# EAGLE design SimpleEXGCircuit (EAGLE 9.2.2)
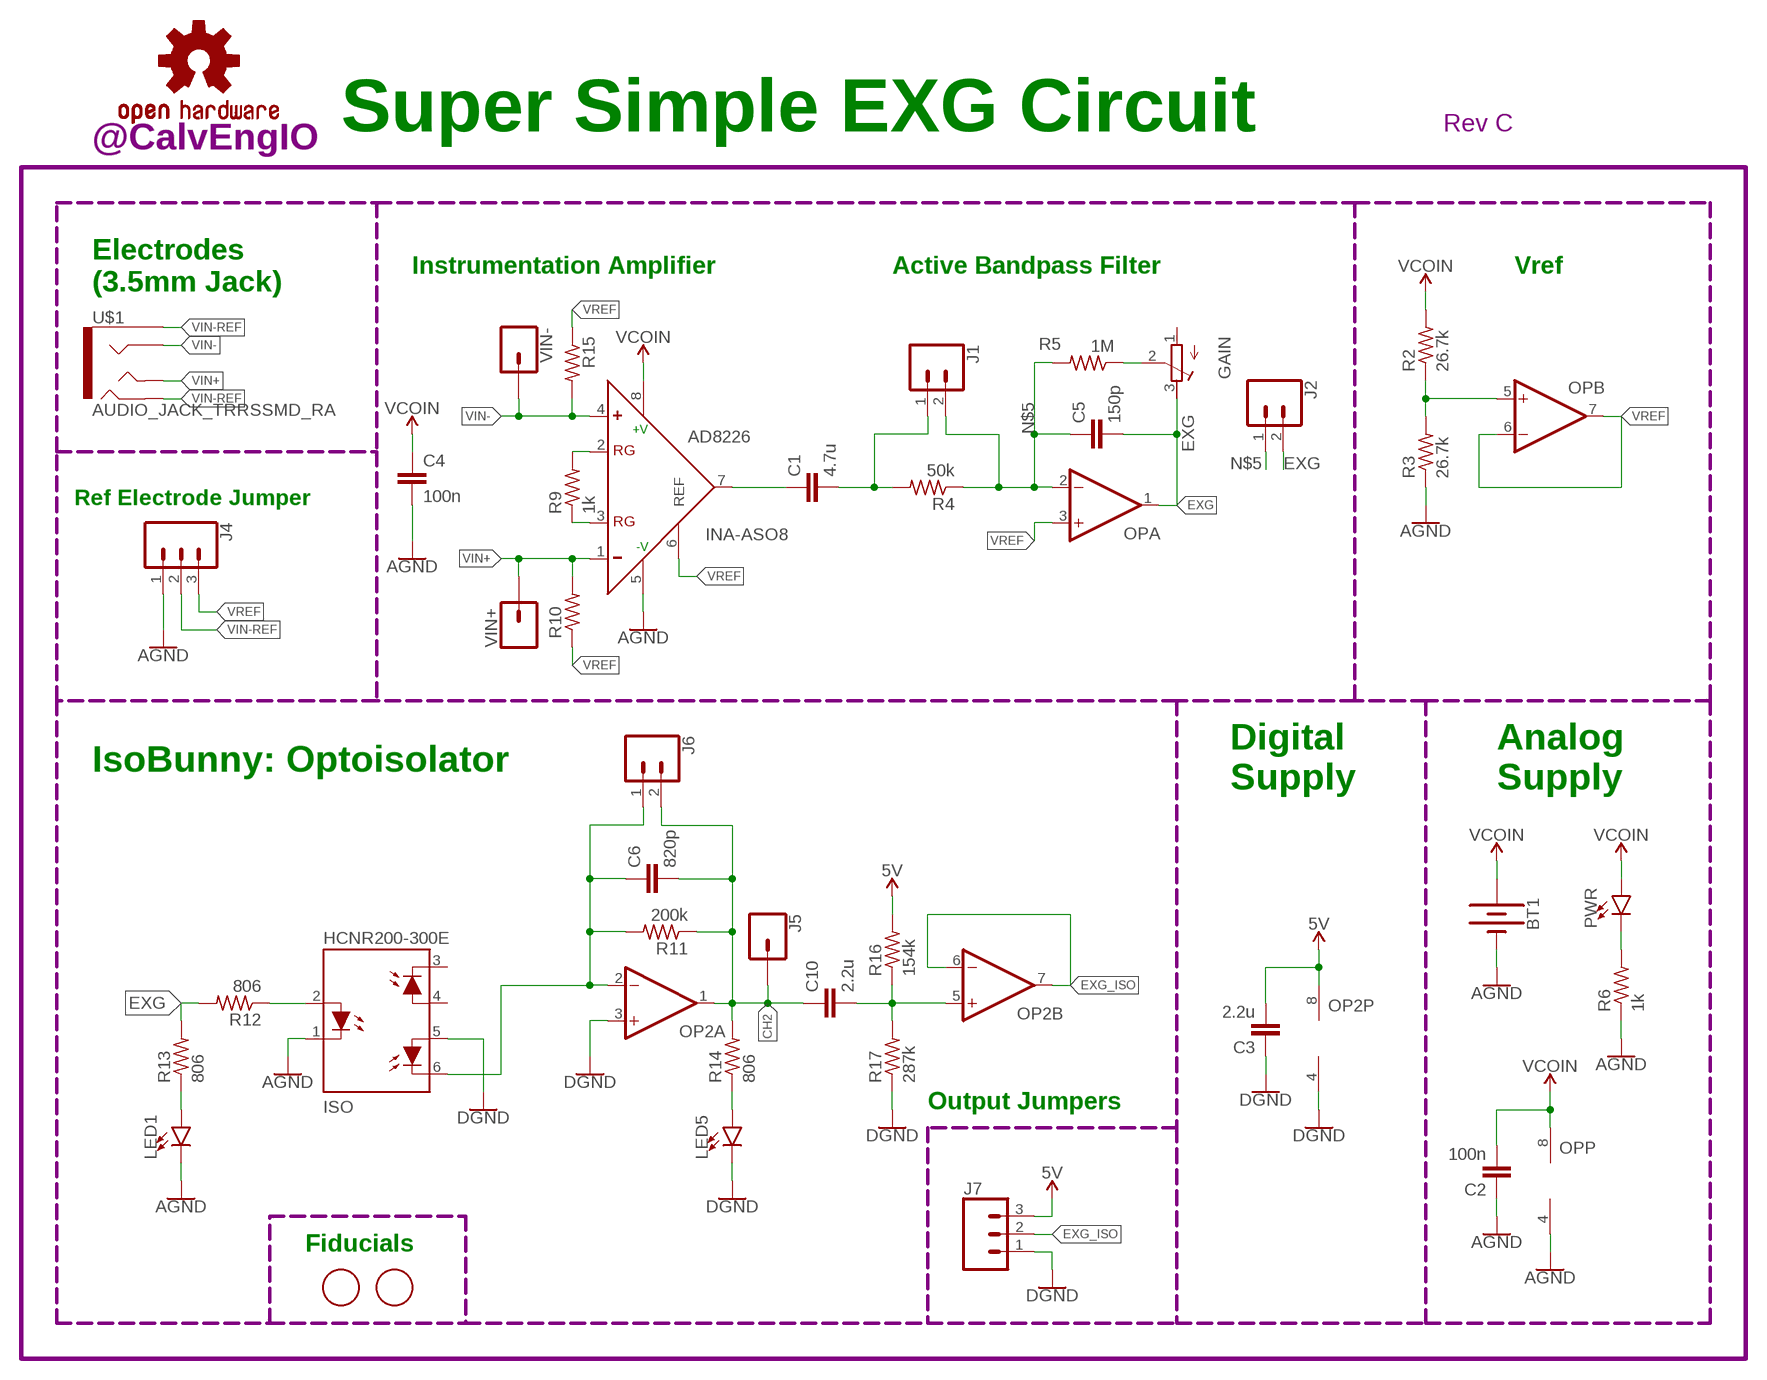
[diagram p0: schematic, sheet 1]

## Parts
AD8226  INA-ASO8  [SO8]
BT1  BATTERY-20MM_SMD_4LEGS_OVERPASTE  [BATTCON_20MM_4LEGS_OVERPASTE]
C1  4.7u  CAPACITOR0603  [C0603]
C2  100n  CAPACITOR0603  [C0603]
C3  2.2u  CAPACITOR0603  [C0603]
C4  100n  CAPACITOR0603  [C0603]
C5  150p  CAPACITOR0603  [C0603]
C6  820p  CAPACITOR0603  [C0603]
C10  2.2u  CAPACITOR0603  [C0603]
GAIN  TRIM-POT-P160  [16MMROTARYPOT]
ISO  HCNR200-300E  [DIP8-400]
J1  CONN_02  [1X02]
J2  CONN_02  [1X02]
J4  CONN_03  [1X03]
J5  CONN_01PTH_NO_SILK_KIT  [1X01NS_KIT]
J6  CONN_02  [1X02]
J7  CONN_03  [1X03]
LED1  LED1206  [LED-1206]
LED5  LED1206  [LED-1206]
LOGO1  REVISION.C  [REV.C]
LOGO4  OSHW-LOGOL  [OSHW-LOGO-L]
OP  OP-DUALR  [SO8]
OP2  OP-DUALR  [SO8]
PWR  LED1206  [LED-1206]
R2  26.7k  RESISTOR0603  [R0603]
R3  26.7k  RESISTOR0603  [R0603]
R4  50k  RESISTOR0603  [R0603]
R5  1M  RESISTOR0603  [R0603]
R6  1k  RESISTOR0603  [R0603]
R9  1k  RESISTOR0603  [R0603]
R10  RESISTOR0603  [R0603]
R11  200k  RESISTOR0603  [R0603]
R12  806  RESISTOR0603  [R0603]
R13  806  RESISTOR0603  [R0603]
R14  806  RESISTOR0603  [R0603]
R15  RESISTOR0603  [R0603]
R16  154k  RESISTOR0603  [R0603]
R17  287k  RESISTOR0603  [R0603]
U$1  AUDIO_JACK_TRRSSMD_RA  [AUDIO_JACK_3.5MM_TRRS_SMD_RA]
U$4  CALVENGIO_HANDLEHANDLE.05  [CALVENGIO_HANDLE.05]
U$5  FIDUCIAL  [FIDUCIAL_1MM]
U$6  FIDUCIAL  [FIDUCIAL_1MM]
VIN+  CONN_01  [1X01]
VIN-  CONN_01  [1X01]

## Nets
5V: C3.2 J7.3 OP2.8(P:V+) R16.2
AGND: AD8226.5(-V) BT1.2(-) C2.1 C4.2 ISO.1(C) J4.1 LED1.C OP.4(P:V-) R3.1 R6.1
CH2: C6.2 C10.1 J5.1 J6.2 OP2.1(A:OUT) R11.1 R14.2
DGND: C3.1 ISO.5(A2) J7.1 LED5.C OP2.3(A:+IN) OP2.4(P:V-) R17.1
EXG: C5.2 GAIN.3(E) J2.2 OP.1(A:OUT) R12.2 R13.2
EXG_ISO: J7.2 OP2.6(B:-IN) OP2.7(B:OUT)
INA: AD8226.7(OUT) C1.1
N$1: GAIN.2(S) R5.1
N$2: AD8226.2(RG) R9.2
N$3: OP.5(B:+IN) R2.1 R3.2
N$5: C5.1 J1.2 J2.1 OP.2(A:-IN) R4.1 R5.2
N$6: PWR.C R6.2
N$7: AD8226.3(RG) R9.1
N$8: C1.2 J1.1 R4.2
N$10: C6.1 ISO.6(C2) J6.1 OP2.2(A:-IN) R11.2
N$11: ISO.2(A) R12.1
N$12: C10.2 OP2.5(B:+IN) R16.1 R17.2
N$17: LED1.A R13.1
N$19: LED5.A R14.1
VCOIN: AD8226.8(+V) BT1.1(+) C2.2 C4.1 OP.8(P:V+) PWR.A R2.2
VIN+: AD8226.1(IN-) R10.2 U$1.TIP VIN+.1
VIN-: AD8226.4(IN+) R15.2 U$1.RING1 VIN-.1
VIN-REF: J4.2 U$1.EARTH U$1.RING2
VREF: AD8226.6(REF) J4.3 OP.3(A:+IN) OP.6(B:-IN) OP.7(B:OUT) R10.1 R15.1
Unconnected: GAIN.1(A) ISO.3(C1) ISO.4(A1)

## Notes on the sheet
- Super Simple EXG Circuit
- Instrumentation Amplifier | Active Bandpass Filter | Vref
- Electrodes
  (3.5mm Jack)
- Ref Electrode Jumper
- IsoBunny: Optoisolator
- Digital
  Supply
- Analog
  Supply
- Output Jumpers
- Fiducials

## Library data of the parts
AD8226 = CalvEngIO-AnalogIC:INA-A: Generic symbol and footprint for single supply instrumentation amplifier Fits AD8220, AD8226, AD8227, and others Source: http://www.analog.com/media/en/technical-documentation/data-sheets/AD8227.pdf
BT1 = CalvEngIO-Connectors:BATTERY: Battery - Single Cell A variety of battery chemistries, sizes, and footprints. Device List: 20MM_PTH - Coin Cell Battery Holder - 20mm (PTH) <https://www.sparkfun.com/products/783> 6.8MM_PTH - Coin Cell Battery Holder - 6.8MM(SMD) <https://www.digikey.com/product-detail/en/seiko-instruments/MS621FE-FL11E/728-1057-ND/1889208?WT.srch=1&gclid=CNOQ5a6LzdQCFZS2wAodXCkE0g> 12MM_SMD - Coin Cell Battery Holder - 12mm (SMD) <https://www.sparkfun.com/products/10592> 12MM_PTH - Coin Cell Battery Holder - 12mm (PTH) <https://www.sparkfun.com/products/7948> 20MM_SMD - 20mm Coin Cell Battery Holder (SMD) (2 legs) Used on the Big Time Watch Kit <https://www.sparkfun.com/products/11734> 20MM_SMD_4LEGS - Coin Cell Battery Holder - 20mm (SMD) <https://www.sparkfun.com/products/11892> 20MM_SMD_4LEGS_OVERPASTE - Coin Cell Battery Holder - 20mm (SMD) <https://www.sparkfun.com/products/11892> (Over-paste on the legs) 24.5MM_PTH - Coin Cell Battery Holder - 24.5mm (PTH) <https://www.sparkfun.com/products/8863> 9V - 9V Battery Holder - PC Mount Used on the SparkFun SparkPunk Sound Kit <https://www.sparkfun.com/products/11177> and SparkFun SparkPunk Sequencer Kit <https://www.sparkfun.com/products/12707> 18650 - Battery Holder - 18650 (PTH) <https://www.sparkfun.com/products/13113> AA - Battery Holder - 1xAA (PTH) <https://www.sparkfun.com/products/7949> AAA - Battery Holder - 1xAAA (PTH) <https://www.sparkfun.com/products/12718> AA_KIT - Battery Holder - 1xAA (PTH) <https://www.sparkfun.com/products/7949> Special kit package - pads only have exposed copper on one side of the board. AAA_KIT - Battery Holder - 1xAAA (PTH) <https://www.sparkfun.com/products/12718> Special kit package - pads only have exposed copper on one side of the board.; PROD_ID: PRT-11892; SF_SKU: BATT-10373
C1-C6 C10 = CalvEngIO-Passives:CAPACITOR
GAIN = CalvEngIO-Passives:TRIM-POT-P160
ISO = avago:HCNR20*: High-Linearity Analog Optocouplers Source: AV02-0886EN+DS+HCNR200+10Dec2011.pdf
J1 J2 J6 = CalvEngIO-Connectors:CONN_02: Multi connection point. Often used as Generic Header-pin footprint for 0.1 inch spaced/style header connections On any of the 0.1 inch spaced packages, you can populate with these: Break Away Headers - Straight <https://www.sparkfun.com/products/116> (PRT-00116) Break Away Male Headers - Right Angle <https://www.sparkfun.com/products/553> (PRT-00553) Female Headers <https://www.sparkfun.com/products/115> (PRT-00115) Break Away Headers - Machine Pin <https://www.sparkfun.com/products/117> (PRT-00117) Break Away Female Headers - Swiss Machine Pin <https://www.sparkfun.com/products/743> (PRT-00743) For SCREWTERMINALS and SPRING TERMINALS visit here: Screw Terimnals on SparkFun.com <https://www.sparkfun.com/search/results?term=Screw+Terminals> (5mm/3.5mm/2.54mm spacing) This device is also useful as a general connection point to wire up your design to another part of your project. Our various solder wires solder well into these plated through hole pads. Hook-Up Wire - Assortment (Stranded, 22 AWG) <https://www.sparkfun.com/products/11375> (PRT-11375) Hook-Up Wire - Assortment (Solid Core, 22 AWG) <https://www.sparkfun.com/products/11367> (PRT-11367) View the entire wire category on our website here <https://www.sparkfun.com/categories/141> Special notes: Molex polarized connector foot print use with: PRT-08233 with associated crimp pins and housings. 2.54_SCREWTERM for use with PRT-10571. 3.5mm Screw Terminal footprints for PRT-08084 5mm Screw Terminal footprints for use with PRT-08432
J4 J7 = CalvEngIO-Connectors:CONN_03: Multi connection point. Often used as Generic Header-pin footprint for 0.1 inch spaced/style header connections On any of the 0.1 inch spaced packages, you can populate with these: Break Away Headers - Straight <https://www.sparkfun.com/products/116> (PRT-00116) Break Away Male Headers - Right Angle <https://www.sparkfun.com/products/553> (PRT-00553) Female Headers <https://www.sparkfun.com/products/115> (PRT-00115) Break Away Headers - Machine Pin <https://www.sparkfun.com/products/117> (PRT-00117) Break Away Female Headers - Swiss Machine Pin <https://www.sparkfun.com/products/743> (PRT-00743) Stackable Header - 3 Pin (Female, 0.1") <https://www.sparkfun.com/products/13875> (PRT-13875) For SCREWTERMINALS and SPRING TERMINALS visit here: Screw Terimnals on SparkFun.com <https://www.sparkfun.com/search/results?term=Screw+Terminals> (5mm/3.5mm/2.54mm spacing) This device is also useful as a general connection point to wire up your design to another part of your project. Our various solder wires solder well into these plated through hole pads. Hook-Up Wire - Assortment (Stranded, 22 AWG) <https://www.sparkfun.com/products/11375> (PRT-11375) Hook-Up Wire - Assortment (Solid Core, 22 AWG) <https://www.sparkfun.com/products/11367> (PRT-11367) View the entire wire category on our website here <https://www.sparkfun.com/categories/141> Special notes: Molex polarized connector foot print use with SKU : PRT-08232 with associated crimp pins and housings.
J5 VIN+ VIN- = CalvEngIO-Connectors:CONN_01: Single connection point. Often used as Generic Header-pin footprint for 0.1 inch spaced/style header connections On any of the 0.1 inch spaced packages, you can populate with these: Break Away Headers - Straight <https://www.sparkfun.com/products/116> (PRT-00116) Break Away Male Headers - Right Angle <https://www.sparkfun.com/products/553> (PRT-00553) Female Headers <https://www.sparkfun.com/products/115> (PRT-00115) Break Away Headers - Machine Pin <https://www.sparkfun.com/products/117> (PRT-00117) Break Away Female Headers - Swiss Machine Pin <https://www.sparkfun.com/products/743> (PRT-00743) This device is also useful as a general connection point to wire up your design to another part of your project. Our various solder wires solder well into these plated through hole pads. Hook-Up Wire - Assortment (Stranded, 22 AWG) <https://www.sparkfun.com/products/11375> (PRT-11375) Hook-Up Wire - Assortment (Solid Core, 22 AWG) <https://www.sparkfun.com/products/11367> (PRT-11367) View the entire wire category on our website here <https://www.sparkfun.com/categories/141> Special notes: SMTSO-256-ET is a "flush mount" nut for a 4-40 screw. We mostly use this on specialty testbeds; it is a nice way to connect hardware to your PCB at an adjustable hieght. Also note, the SNAP packages are for using a snappable style connector. We sell a baggie of snaps and they are also used on two LilyPad designs: Snap Assortment - 30 pack (male and female) <https://www.sparkfun.com/products/11347> (DEV-11347) LilyPad Arduino SimpleSnap <https://www.sparkfun.com/products/10941> (DEV-10941) LilyPad SimpleSnap Protoboard <https://www.sparkfun.com/products/10940> (DEV-10940)
LED1 LED5 PWR = CalvEngIO-LED:LED: LED (Generic) Standard schematic elements and footprints for 5mm, 3mm, 1206, and 0603 sized LEDs. Generic LEDs with no color specified. LTST-C190KGKT: arrow indicates cathode
LOGO1 = CalvEngIO-Logos:REVISION.C
LOGO4 = CalvEngIO-Logos:OSHW-LOGO: Open-Source Hardware (OSHW) Logo This logo indicates the piece of hardware it is found on incorporates a OSHW license and/or adheres to the definition of open source hardware found here: http://freedomdefined.org/OSHW
OP OP2 = CalvEngIO-AnalogIC:OP-DUAL: Precision Micropower, Low Noise CMOS, Rail-to-Rail Input/Output Operational Amplifiers Source: http://www.analog.com/static/imported-files/data_sheets/AD8603_8607_8609.pdf; MPN: AD8607ARMZ-R2; OC_FARNELL: 1651293; OC_NEWARK: 19M8927
R2-R6 R9-R17 = CalvEngIO-Passives:RESISTOR
U$1 = CalvEngIO-Connectors:AUDIO_JACK_TRRS: Audio Jack - 3.5mm TRRS (SMD) This is a 3.5mm TRRS SMD audio jack. TRRS connectors are the audio-style connectors that you see on some phones, MP3 players and development boards. TRRS stands for “tip, ring, ring, sleeve,” which reflects that this has three conductors and a ground. SparkFun Products: Audio Jack <https://www.sparkfun.com/products/12639> mbed Starter Kit <https://www.sparkfun.com/products/12968> SparkFun TRRS 3.5mm Jack Breakout <https://www.sparkfun.com/products/11570>; PROD_ID: CONN-10676; SF_ID: PRT-12639
U$4 = CalvEngIO-Logos:CALVENGIO_HANDLE
U$5 U$6 = CalvEngIO-Connectors:FIDUCIAL: For use by pick and place machines to calibrate the vision/machine, 1mm By microbuilder.eu

## Board
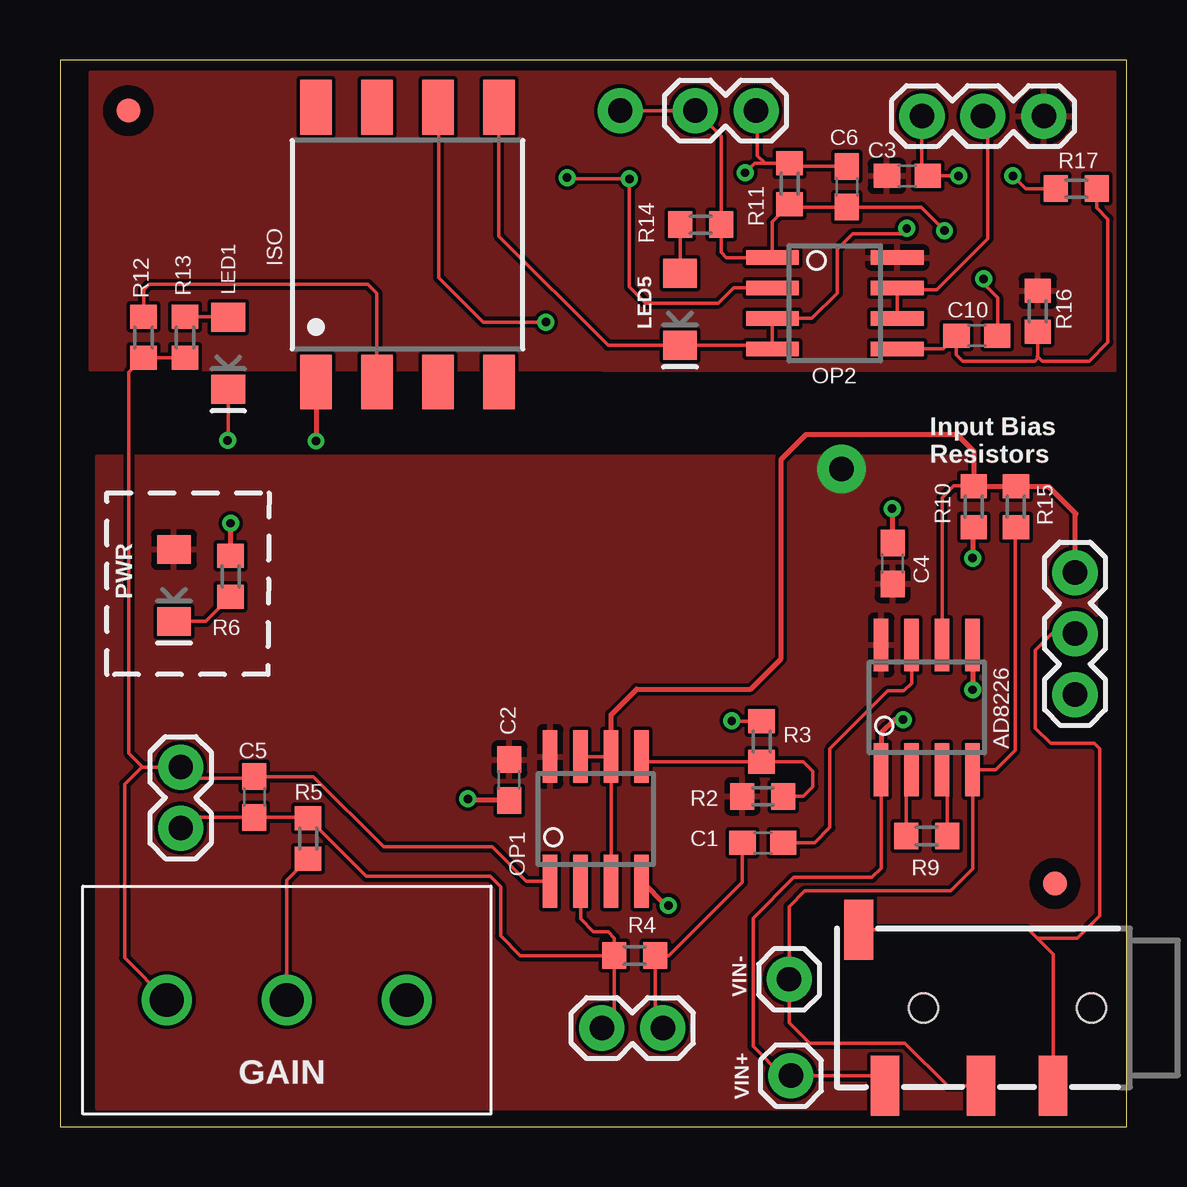
[diagram p1: board, top side]
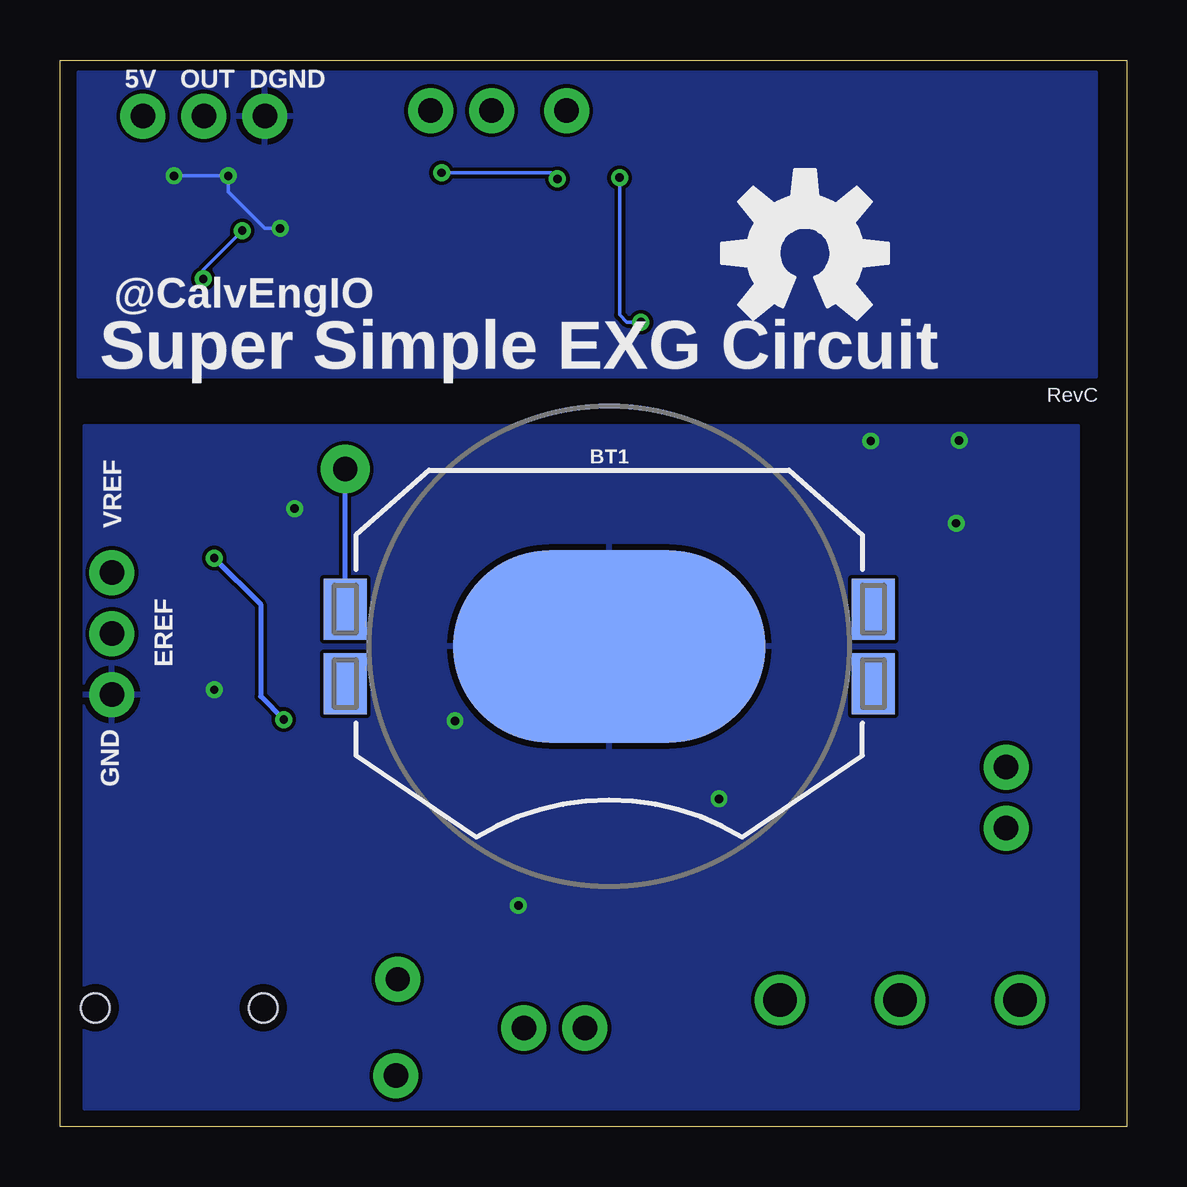
[diagram p2: board, bottom side, seen from below]

Size 44.45 x 44.45 mm. Coordinates in mm from the lower left corner, seen from the top.
Outline: 0,0 44.45,0 44.45,44.45 0,44.45 0,0
Copper layers (1*16): Top 0.0356mm / dielectric 1.5011mm / Bottom 0.0356mm
Design rules "LaenPCBOrder": minimum track width 6mil, minimum drill 13mil, track to track 6mil, track to pad 6mil, pad to pad 6mil, via to via 6mil, smd to smd 6mil, copper to edge 15mil, drill to drill 6mil, minimum pad ring 7mil, minimum via ring 7mil, stop-mask expansion 3mil, vias tented up to drill 0mil, thermal gap 10mil

### Footprints (pad centres in the part's own frame; a part is rotated, then mirrored left to right if it is on the bottom)
SO8 = smd 0.6 x 2.2: 1 -1.905,-2.6; 2 -0.635,-2.6; 3 0.635,-2.6; 4 1.905,-2.6; 5 1.905,2.6; 6 0.635,2.6; 7 -0.635,2.6; 8 -1.905,2.6
BATTCON_20MM_4LEGS_OVERPASTE = smd 1.778 x 2.54: 1 -11,1.55; 3 11,1.55; P$1 -11,-1.55; P$2 11,-1.55 | smd 13 x 8: 2 0,0
C0603 = smd 1.1 x 1: 1 -0.85,0; 2 0.85,0
16MMROTARYPOT = drill 1.4: 1 -5,0; 2 0,0; 3 5,0
DIP8-400 = smd 1.3 x 2.29: 1 -3.81,-5.72; 2 -1.27,-5.72; 3 1.27,-5.72; 4 3.81,-5.72; 5 3.81,5.72; 6 1.27,5.72; 7 -1.27,5.72; 8 -3.81,5.72
1X02 = drill 1.016 pad 1.88: 1 0,0; 2 2.54,0
1X03 = drill 1.016 pad 1.88: 1 0,0; 2 2.54,0; 3 5.08,0
1X01NS_KIT = drill 1.016 pad 1.88: 1 0,0
LED-1206 = smd 1.2 x 1.4: A -1.5,0; C 1.5,0
R0603 = smd 1 x 1.1: 1 -0.85,0; 2 0.85,0
AUDIO_JACK_3.5MM_TRRS_SMD_RA = smd 1.2 x 2.5: EARTH 11.3,-3.25; RING1 6.2,3.25; RING2 3.2,3.25; TIP 10.2,3.25 | hole 1.2: 1.6,0; 8.6,0
FIDUCIAL_1MM = smd 1 x 1: 1 0,0
1X01 = drill 1.016 pad 1.88: 1 0,0

### Placement (x,y rotation side)
AD8226  36.12,17.48 0 top
BT1  21.56,20.02 0 bottom
C1  29.29,11.84 180 top
C2  18.72,14.45 90 top
C3  35.31,39.62 180 top
C4  34.7,23.47 90 top
C5  8.1,13.74 90 top
C6  32.79,39.17 270 top
C10  38.2,32.97 180 top
GAIN  9.45,5.28 180 top
ISO  14.48,36.75 0 top
J1  25.12,4.11 180 top
J2  5.03,12.45 90 top
J4  42.29,18.01 90 top
J5  23.34,42.34 0 top
J6  29.01,42.34 180 top
J7  35.92,42.11 0 top
LED1  7.01,32.23 270 top
LED5  25.83,34.06 270 top
LOGO1  3.33,30.2 0 bottom
LOGO4  13.41,36.4 0 bottom
OP  22.33,12.83 0 top
OP2  32.28,34.32 270 top
PWR  4.75,22.56 270 top
R2  29.29,13.77 180 top
R3  29.24,16.05 270 top
R4  23.95,7.14 0 top
R5  10.34,12.01 90 top
R6  7.11,22.94 270 top
R9  36.12,12.12 180 top
R10  38.07,25.83 270 top
R11  30.4,39.29 90 top
R12  3.48,32.89 270 top
R13  5.21,32.89 270 top
R14  26.7,37.59 0 top
R15  39.83,25.83 270 top
R16  40.74,33.99 90 top
R17  42.34,39.09 0 top
U$1  44.58,4.95 180 top
U$4  37.13,34.11 0 bottom
U$5  2.84,42.34 0 top
U$6  41.45,10.13 0 top
VIN+  30.45,2.13 0 top
VIN-  30.38,6.15 0 top

### Tracks (layer width: path | path; a pad name or v marks a point on that pad's centre or on a via)
5V
  pour Top: 43.94,43.94 43.94,31.5 1.27,31.55 1.27,43.94
AGND  (via drill 0.35)
  Top 0.152: 38.03,20.07 AD8226.5 | 29.22,16.92 R3.1 28,16.9 v27.99,16.92 | OP.4 24.39,10.39 | ISO.1 10.59,31.03 10.67,30.96 | LED1.C 7.01,28.63 v6.99,28.6
  Top 0.203: R6.1 v7.11,25.15 | ISO.1 v10.67,28.57 | OP.4 25.24,9.22 v25.35,9.22 | C2.1 17.05,13.6 v16.99,13.66 | AD8226.5 v38.02,18.21 | C4.2 34.7,25.73 v34.67,25.76
  Bottom 0.152: 21.57,19.61 BT1.2
  pour Bottom: 43.43,29.21 43.43,0.76 2.03,0.76 2.03,29.21
CH2  (via drill 0.35)
  Top 0.152: 29.67,36.22 27.76,36.22 27.55,36.44 R14.2 27.55,41.26 J6.2 J5.1 | 29.67,36.22 OP2.1 | 29.67,36.22 29.67,37.71 R11.1 30.53,38.32 C6.2 35.88,38.32 v36.85,37.34 | v38.48,35.33 38.48,35.13 39.06,34.54 39.06,32.98 C10.1
  Bottom 0.152: v36.85,37.34 38.48,35.71 v38.48,35.33
DGND  (via drill 0.35)
  Top 0.152: J7.1 35.92,39.86 C3.1 v37.44,39.62 | v35.28,37.43 35.05,37.2 33.02,37.2 32.39,36.56 32.39,34.74 31.33,33.68 OP2.3 OP2.4 29.53,32.56 LED5.C 22.84,32.56 18.29,37.11 ISO.5 | R17.1 40.23,39.09 v39.7,39.62
  Bottom 0.152: v35.28,37.43 35.92,37.43 37.44,38.95 v37.44,39.62 v39.7,39.62
  pour Bottom: 1.27,43.94 43.69,43.94 43.69,31.24 1.27,31.24
EXG
  Top 0.152: OP.1 19.43,10.24 18.01,11.66 13.49,11.66 10.55,14.59 C5.2 8.04,14.53 5.49,14.53 J2.2 | J2.2 3.45,14.99 | 3.45,14.99 3.4,14.99 2.69,14.28 2.69,7.04 GAIN.3 | 4.9,14.99 J2.2 | 3.45,14.99 2.87,15.57 2.87,31.43 R12.2 R13.2
EXG_ISO
  Top 0.152: OP2.6 34.88,34.87 | 34.88,34.87 OP2.7 | 34.88,34.87 36.52,34.87 38.66,37.01 38.66,41.91 J7.2
INA
  Top 0.152: AD8226.7 35.48,18.49 35.15,18.16 34.49,18.16 32.08,15.75 32.08,12.47 31.45,11.84 C1.1
N$1
  Top 0.152: GAIN.2 9.45,10.28 R5.1
N$2
  Top 0.152: R9.2 35.27,14.66 AD8226.2
N$3
  Top 0.152: R2.1 30.96,13.77 31.37,14.17 31.37,14.81 30.97,15.2 R3.2 24.46,15.2 OP.5
N$5
  Top 0.152: R4.1 19.18,7.14 18.36,7.95 18.36,10.01 17.93,10.44 12.76,10.44 R5.2 10.31,12.89 C5.1 5.47,12.89 J2.1 | OP.2 21.69,8.66 22.23,8.13 22.84,8.13 23.1,7.86 R4.1 | R4.1 23.1,4.64 J1.2
N$6
  Top 0.152: PWR.C 6.08,21.05 R6.2
N$7
  Top 0.152: R9.1 36.97,14.66 AD8226.3
N$8
  Top 0.152: J1.1 24.8,4.43 R4.2 25.38,7.14 28.44,10.2 C1.2
N$10  (via drill 0.35)
  Top 0.152: OP2.2 28.07,34.95 27.43,34.31 24.41,34.31 23.72,35 v23.72,39.5 21.18,39.5 v21.13,39.55 | C6.1 30.53,40.02 R11.2 | J6.1 29.06,42.29 29.06,40.46 29.38,40.14 R11.2 | R11.2 28.94,40.14 v28.55,39.75 | ISO.6 15.77,42.45 15.77,35.38 17.63,33.53 v20.24,33.53
  Bottom 0.152: v28.55,39.75 23.98,39.75 v23.72,39.5 | v21.13,39.55 21.13,33.83 20.83,33.53 v20.24,33.53
N$11
  Top 0.152: R12.1 3.48,34.87 3.71,35.1 12.83,35.1 13.21,34.72 ISO.2
N$12
  Top 0.152: 40.77,32.05 40.92,31.9 42.88,31.9 43.66,32.69 43.66,37.82 43.19,38.29 R17.2 | 40.77,32.05 40.72,32.11 40.74,32.13 R16.1 | OP2.5 36.79,32.41 C10.2 37.35,32.17 37.62,31.9 40.62,31.9 40.77,32.05
N$17
  Top 0.152: R13.1 7,33.74 LED1.A
N$19
  Top 0.152: LED5.A 25.84,35.58 R14.1
VCOIN  (via drill 1.02 pad 2.03)
  Bottom 0.203: BT1.1 v32.56,27.41
  pour Top: 43.18,27.94 43.18,0.76 1.52,0.76 1.52,27.94
VIN+  (via drill 0.35)
  Top 0.152: 34.21,14.78 AD8226.1 34.21,10.77 33.83,10.39 30.58,10.39 28.88,8.69 28.88,3.35 30.1,2.13 VIN+.1 33.95,2.13 U$1.TIP
  Top 0.203: R10.2 38.02,24.93 v38.02,23.7 | v35.13,16.97 34.77,16.97 34.21,16.41 34.21,14.78
  Bottom 0.203: v38.02,23.7 36.09,21.77 36.09,17.93 v35.13,16.97
VIN-
  Top 0.152: U$1.RING1 36.98,1.7 35.2,3.48 31.24,3.48 30.38,4.34 VIN-.1 30.38,9.17 31.04,9.83 37.11,9.83 38.02,10.74 AD8226.4 | AD8226.4 38.02,14.81 38.05,14.78 | 39.78,24.93 R15.2 39.8,24.96 39.8,15.7 38.98,14.88 AD8226.4
VIN-REF
  Top 0.152: 40.72,7.85 42.39,7.85 43.33,8.79 43.33,15.75 43.1,15.98 41.27,15.98 40.64,16.61 40.64,19.86 41.33,20.55 J4.2 | U$1.EARTH 40.36,8.2 40.72,7.85 | U$1.RING2 41.38,7.19 40.72,7.85
VREF
  Top 0.152: OP.7 OP.6 OP.3 | AD8226.6 36.75,26.21 37.25,26.71 38.05,26.71 R10.1
  Top 0.203: OP.6 22.96,17.17 24.03,18.24 28.78,18.24 30.05,19.51 30.05,27.81 31.09,28.85 37.36,28.85 38.08,28.14 R10.1 R15.1 41.19,26.68 42.34,25.53 42.29,25.48 J4.3

### Text on the board
tPlace: Input Bias / Resistors | AD8226 | OP1
bPlace: DGND | OUT | 5V | Super Simple EXG Circuit | VREF | EREF | GND